# EAGLE schematic switches (EAGLE 6.5.0)
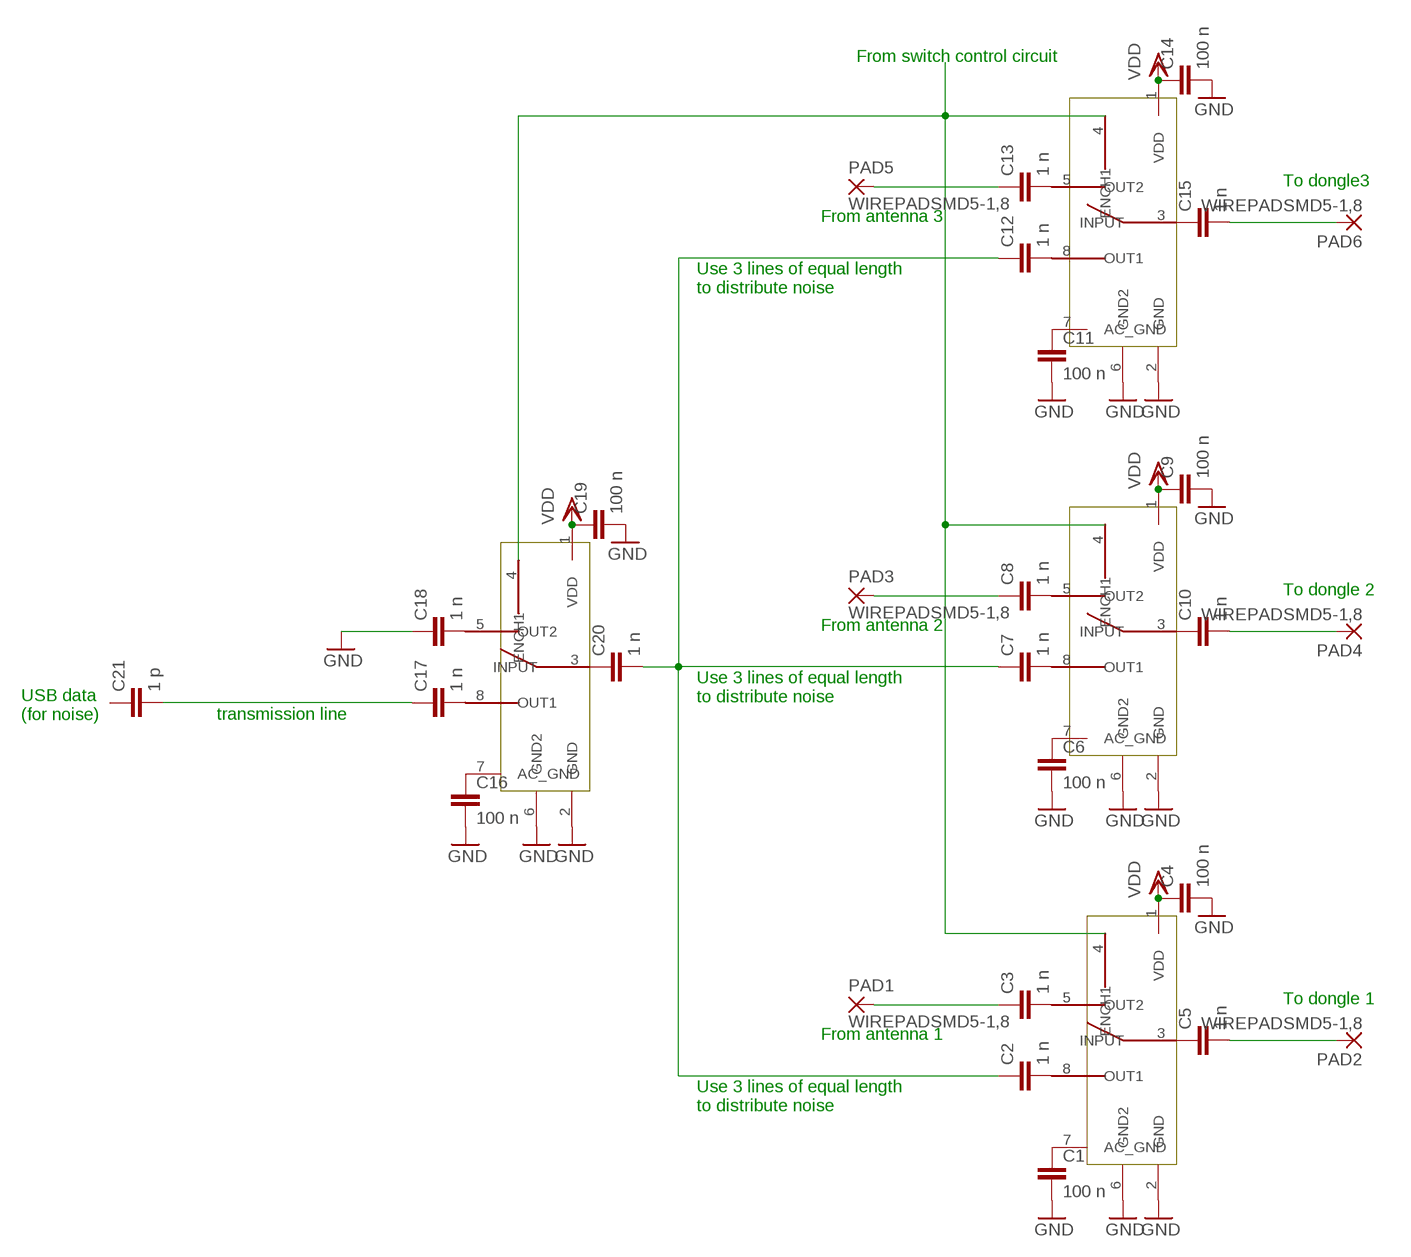
[diagram p0: schematic, sheet 1]

## Parts
C1  100 n  C-EUC0805  [C0805]
C2  1 n  C-EUC0805  [C0805]
C3  1 n  C-EUC0805  [C0805]
C4  100 n  C-EUC0805  [C0805]
C5  1 n  C-EUC0805  [C0805]
C6  100 n  C-EUC0805  [C0805]
C7  1 n  C-EUC0805  [C0805]
C8  1 n  C-EUC0805  [C0805]
C9  100 n  C-EUC0805  [C0805]
C10  1 n  C-EUC0805  [C0805]
C11  100 n  C-EUC0805  [C0805]
C12  1 n  C-EUC0805  [C0805]
C13  1 n  C-EUC0805  [C0805]
C14  100 n  C-EUC0805  [C0805]
C15  1 n  C-EUC0805  [C0805]
C16  100 n  C-EUC0805  [C0805]
C17  1 n  C-EUC0805  [C0805]
C18  1 n  C-EUC0805  [C0805]
C19  100 n  C-EUC0805  [C0805]
C20  1 n  C-EUC0805  [C0805]
C21  1 p  C-EUC0805  [C0805]
PAD1  WIREPADSMD5-1,8  [5-1,8]
PAD2  WIREPADSMD5-1,8  [5-1,8]
PAD3  WIREPADSMD5-1,8  [5-1,8]
PAD4  WIREPADSMD5-1,8  [5-1,8]
PAD5  WIREPADSMD5-1,8  [5-1,8]
PAD6  WIREPADSMD5-1,8  [5-1,8]
U$1  SA630  [SOIC8]
U$2  SA630  [SOIC8]
U$3  SA630  [SOIC8]
U$4  SA630  [SOIC8]

## Nets
GND: C1.2 C4.2 C6.2 C9.2 C11.2 C14.2 C16.2 C18.1 C19.2 U$1.2(GND) U$1.6(GND2) U$2.2(GND) U$2.6(GND2) U$3.2(GND) U$3.6(GND2) U$4.2(GND) U$4.6(GND2)
N$1: C1.1 U$1.7(AC_GND)
N$2: C2.2 U$1.8(OUT1)
N$3: C3.2 U$1.5(OUT2)
N$4: C11.1 U$3.7(AC_GND)
N$5: C5.1 U$1.3(INPUT)
N$6: C3.1 PAD1.1(P)
N$7: C5.2 PAD2.1(P)
N$8: C6.1 U$2.7(AC_GND)
N$9: C7.2 U$2.8(OUT1)
N$10: C8.2 U$2.5(OUT2)
N$11: C12.2 U$3.8(OUT1)
N$12: C10.1 U$2.3(INPUT)
N$13: C8.1 PAD3.1(P)
N$14: C10.2 PAD4.1(P)
N$15: C17.1 C21.2
N$16: U$1.4(ENCH1) U$2.4(ENCH1) U$3.4(ENCH1) U$4.4(ENCH1)
N$17: C13.2 U$3.5(OUT2)
N$18: C15.1 U$3.3(INPUT)
N$19: C13.1 PAD5.1(P)
N$20: C15.2 PAD6.1(P)
N$21: C16.1 U$4.7(AC_GND)
N$22: C17.2 U$4.8(OUT1)
N$23: C18.2 U$4.5(OUT2)
N$24: C20.1 U$4.3(INPUT)
N$26: C2.1 C7.1 C12.1 C20.2
VDD: C4.1 C9.1 C14.1 C19.1 U$1.1(VDD) U$2.1(VDD) U$3.1(VDD) U$4.1(VDD)
Unconnected: C21.1

## Notes on the sheet
- From switch control circuit
- To dongle3
- From antenna 3
- Use 3 lines of equal length
  to distribute noise
- To dongle 2
- From antenna 2
- Use 3 lines of equal length
  to distribute noise
- USB data
  (for noise)
- transmission line
- To dongle 1
- From antenna 1
- Use 3 lines of equal length
  to distribute noise

## Library data of the parts
C1-C21 = rcl:C-EU: CAPACITOR, European symbol
PAD1-PAD6 = wirepad:WIREPAD: Wire PAD connect wire on PCB
U$1-U$4 = oma:SA630: SA630 rf switch